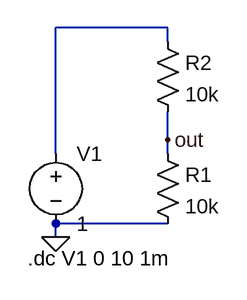
[diagram p0: schematic DC.asc]
DC.asc, the LTspice schematic file:
Version 4
SHEET 1 880 680
WIRE 192 0 64 0
WIRE 192 16 192 0
WIRE 192 128 192 96
WIRE 64 144 64 0
WIRE 192 144 192 128
WIRE 192 224 64 224
WIRE 64 240 64 224
FLAG 64 240 0
FLAG 192 128 out
SYMBOL voltage 64 128 R0
WINDOW 123 0 0 Left 0
WINDOW 39 0 0 Left 0
SYMATTR InstName V1
SYMATTR Value 1
SYMBOL res 176 128 R0
SYMATTR InstName R1
SYMATTR Value 10k
SYMBOL res 176 0 R0
SYMATTR InstName R2
SYMATTR Value 10k
TEXT 32 264 Left 2 !.dc V1 0 10 1m

The netlist it stands for:
* DC.asc
V1 N001 0 1
R1 out 0 10k
R2 N001 out 10k
.dc V1 0 10 1m
.backanno
.end